# EAGLE design adamon (EAGLE 6.5.0)
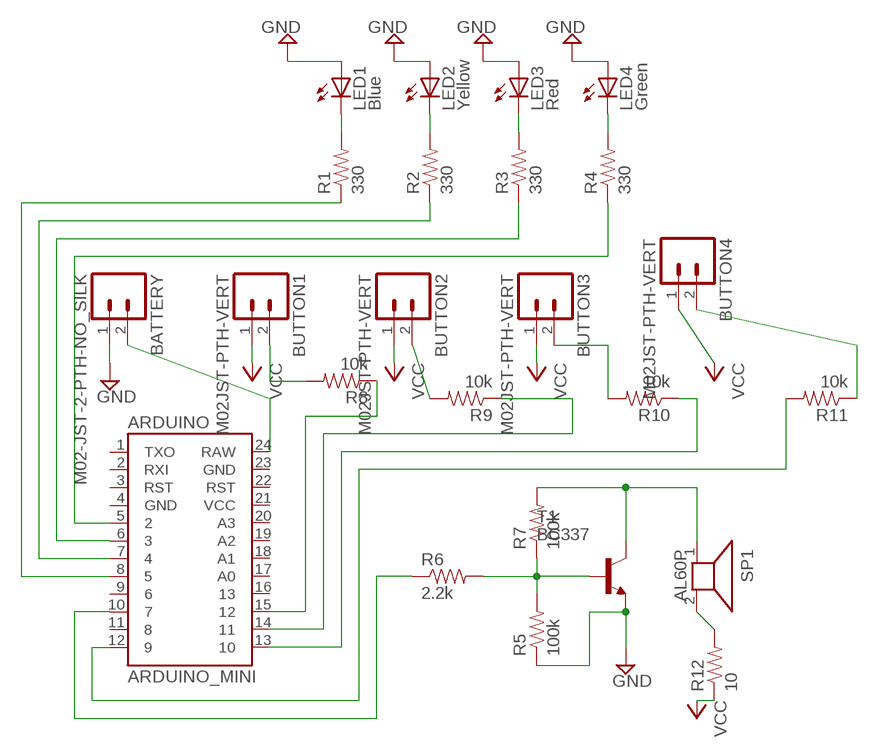
[diagram p0: schematic, sheet 1]

## Parts
ARDUINO  ARDUINO_MINI  [ARDUINO_MINI]
BATTERY  M02-JST-2-PTH-NO_SILK  [JST-2-PTH-NS]
BUTTON1  M02JST-PTH-VERT  [JST-2-PTH-VERT]
BUTTON2  M02JST-PTH-VERT  [JST-2-PTH-VERT]
BUTTON3  M02JST-PTH-VERT  [JST-2-PTH-VERT]
BUTTON4  M02JST-PTH-VERT  [JST-2-PTH-VERT]
LED1  Blue  LED5MM  [LED5MM]
LED2  Yellow  LED5MM  [LED5MM]
LED3  Red  LED5MM  [LED5MM]
LED4  Green  LED5MM  [LED5MM]
R1  330  RESISTORPTH-1/4W  [AXIAL-0.4]
R2  330  RESISTORPTH-1/4W  [AXIAL-0.4]
R3  330  RESISTORPTH-1/4W  [AXIAL-0.4]
R4  330  RESISTORPTH-1/4W  [AXIAL-0.4]
R5  100k  RESISTORPTH-1/4W  [AXIAL-0.4]
R6  2.2k  RESISTORPTH-1/4W  [AXIAL-0.4]
R7  100k  RESISTORPTH-1/4W  [AXIAL-0.4]
R8  10k  RESISTORPTH-1/4W  [AXIAL-0.4]
R9  10k  RESISTORPTH-1/4W  [AXIAL-0.4]
R10  10k  RESISTORPTH-1/4W  [AXIAL-0.4]
R11  10k  RESISTORPTH-1/4W  [AXIAL-0.4]
R12  10  RESISTORPTH-1/4W  [AXIAL-0.4]
SP1  AL60P  [AL60P]
T1  BC337  [TO92]

## Nets
GND: BATTERY.1 LED1.A LED2.A LED3.A LED4.A R5.P$1 T1.1(E)
N$1: LED1.K(C) R1.P$2
N$2: ARDUINO.8 R1.P$1
N$3: ARDUINO.7 R2.P$1
N$4: ARDUINO.6 R3.P$1
N$5: ARDUINO.5 R4.P$1
N$6: LED2.K(C) R2.P$2
N$7: LED3.K(C) R3.P$2
N$8: LED4.K(C) R4.P$2
N$9: BUTTON4.2 R11.P$1
N$10: BUTTON3.2 R10.P$2
N$12: BUTTON2.2 R9.P$2
N$13: ARDUINO.24(RAW) BATTERY.2
N$14: ARDUINO.15 R8.P$1
N$15: ARDUINO.14 R9.P$1
N$16: ARDUINO.13 R10.P$1
N$17: ARDUINO.12 R11.P$2
N$18: R5.P$2 R6.P$2 R7.P$1 T1.2(B)
N$19: R7.P$2 SP1.1 T1.3(C)
N$21: R12.P$2 SP1.2
N$23: BUTTON1.2 R8.P$2
SPKAMP: ARDUINO.10 R6.P$1
VCC: BUTTON1.1 BUTTON2.1 BUTTON3.1 BUTTON4.1 R12.P$1
Unconnected: ARDUINO.1(TXO) ARDUINO.2(RXI) ARDUINO.3(RST) ARDUINO.4(GND) ARDUINO.9 ARDUINO.11 ARDUINO.16 ARDUINO.17(A0) ARDUINO.18(A1) ARDUINO.19(A2) ARDUINO.20(A3) ARDUINO.21(VCC) ARDUINO.22(RST) ARDUINO.23(GND)

## Library data of the parts
ARDUINO = SparkFun-Boards:ARDUINO_MINI: Arduino Pro Mini footprint
BATTERY BUTTON1-BUTTON4 = SparkFun-Connectors:M02: Standard 2-pin 0.1" header. Use with - straight break away headers ( PRT-00116) - right angle break away headers (PRT-00553) - swiss pins (PRT-00743) - machine pins (PRT-00117) - female headers (PRT-00115) Molex polarized connector foot print use with: PRT-08233 with associated crimp pins and housings. 2.54_SCREWTERM for use with PRT-10571. 3.5mm Screw Terminal footprints for PRT-08084 5mm Screw Terminal footprints for use with PRT-08433
LED1-LED4 = SparkFun-LED:LED: LEDs Standard schematic elements and footprints for 5mm, 3mm, 1206, and 0603 sized LEDs. 5mm - Spark Fun Electronics SKU : COM-00529 (and others)
R1-R12 = SparkFun-Passives:RESISTOR: Resistor Basic schematic elements and footprints for 0603, 1206, and PTH resistors.
SP1 = buzzer:AL60P: SPEAKER Source: Buerklin; OC_FARNELL: unknown; OC_NEWARK: unknown
T1 = transistor:BC337: NPN TRANSISTOR

## Board
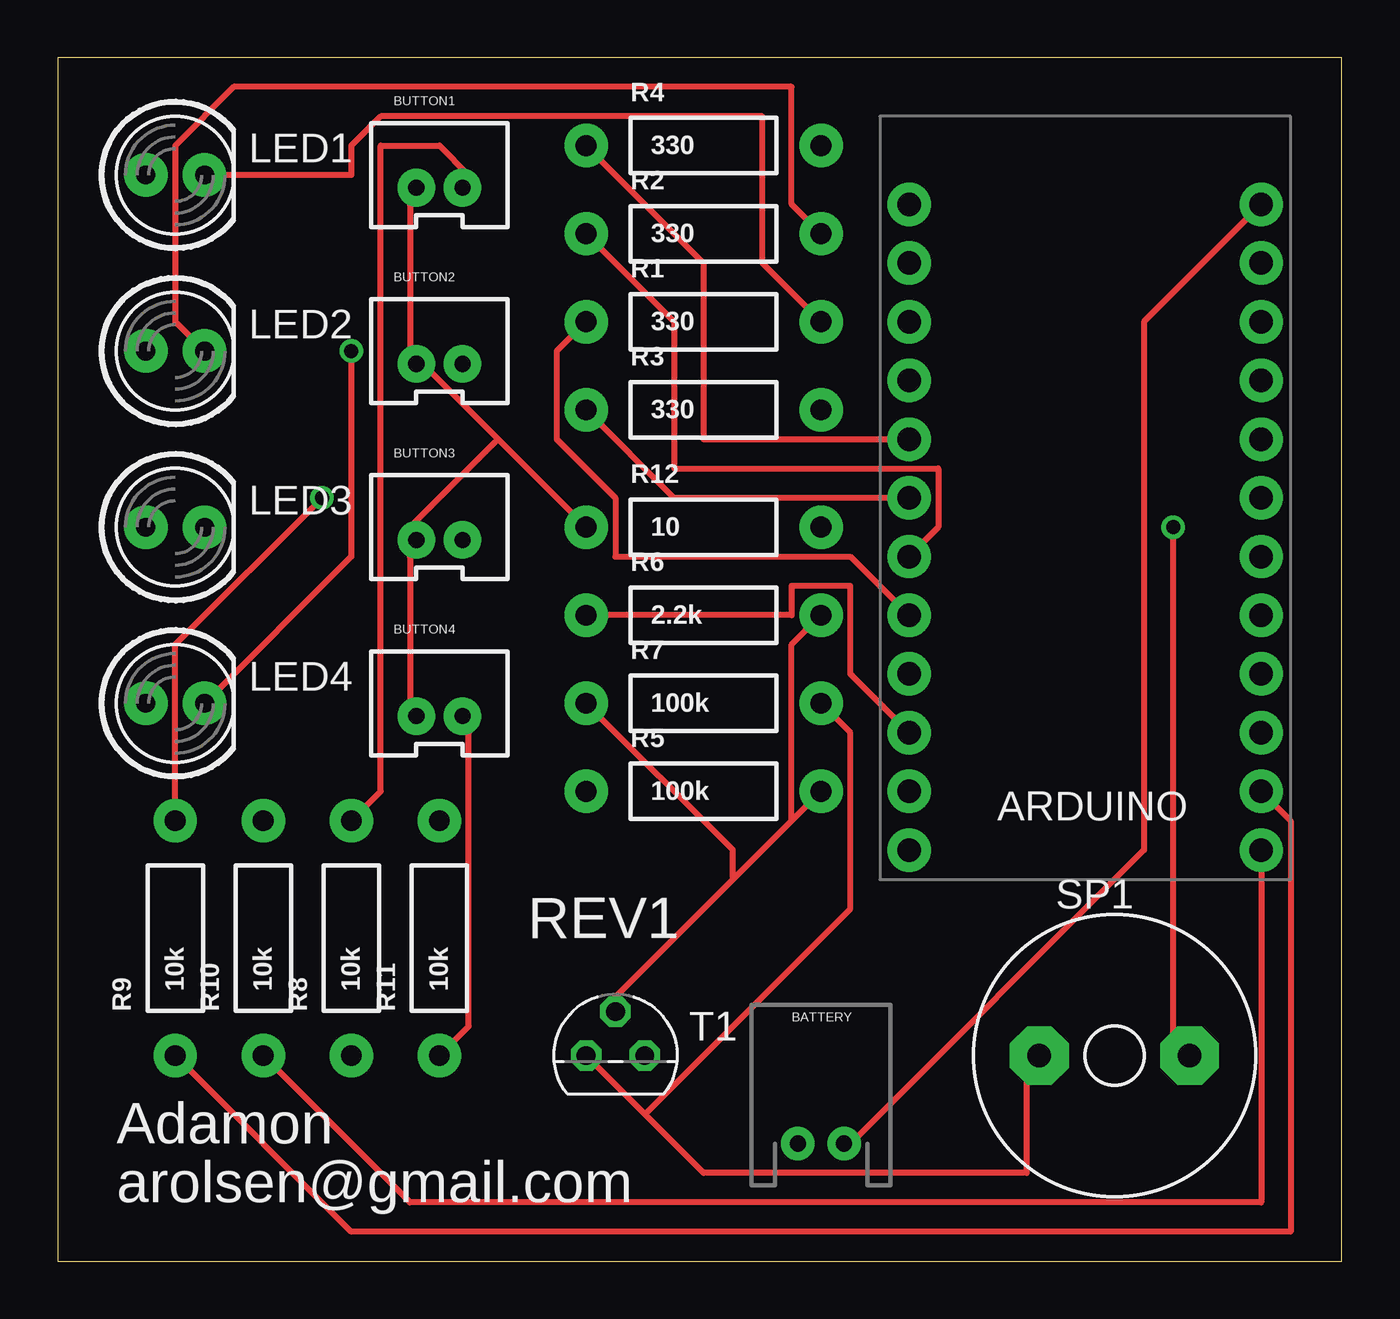
[diagram p1: board, top side]
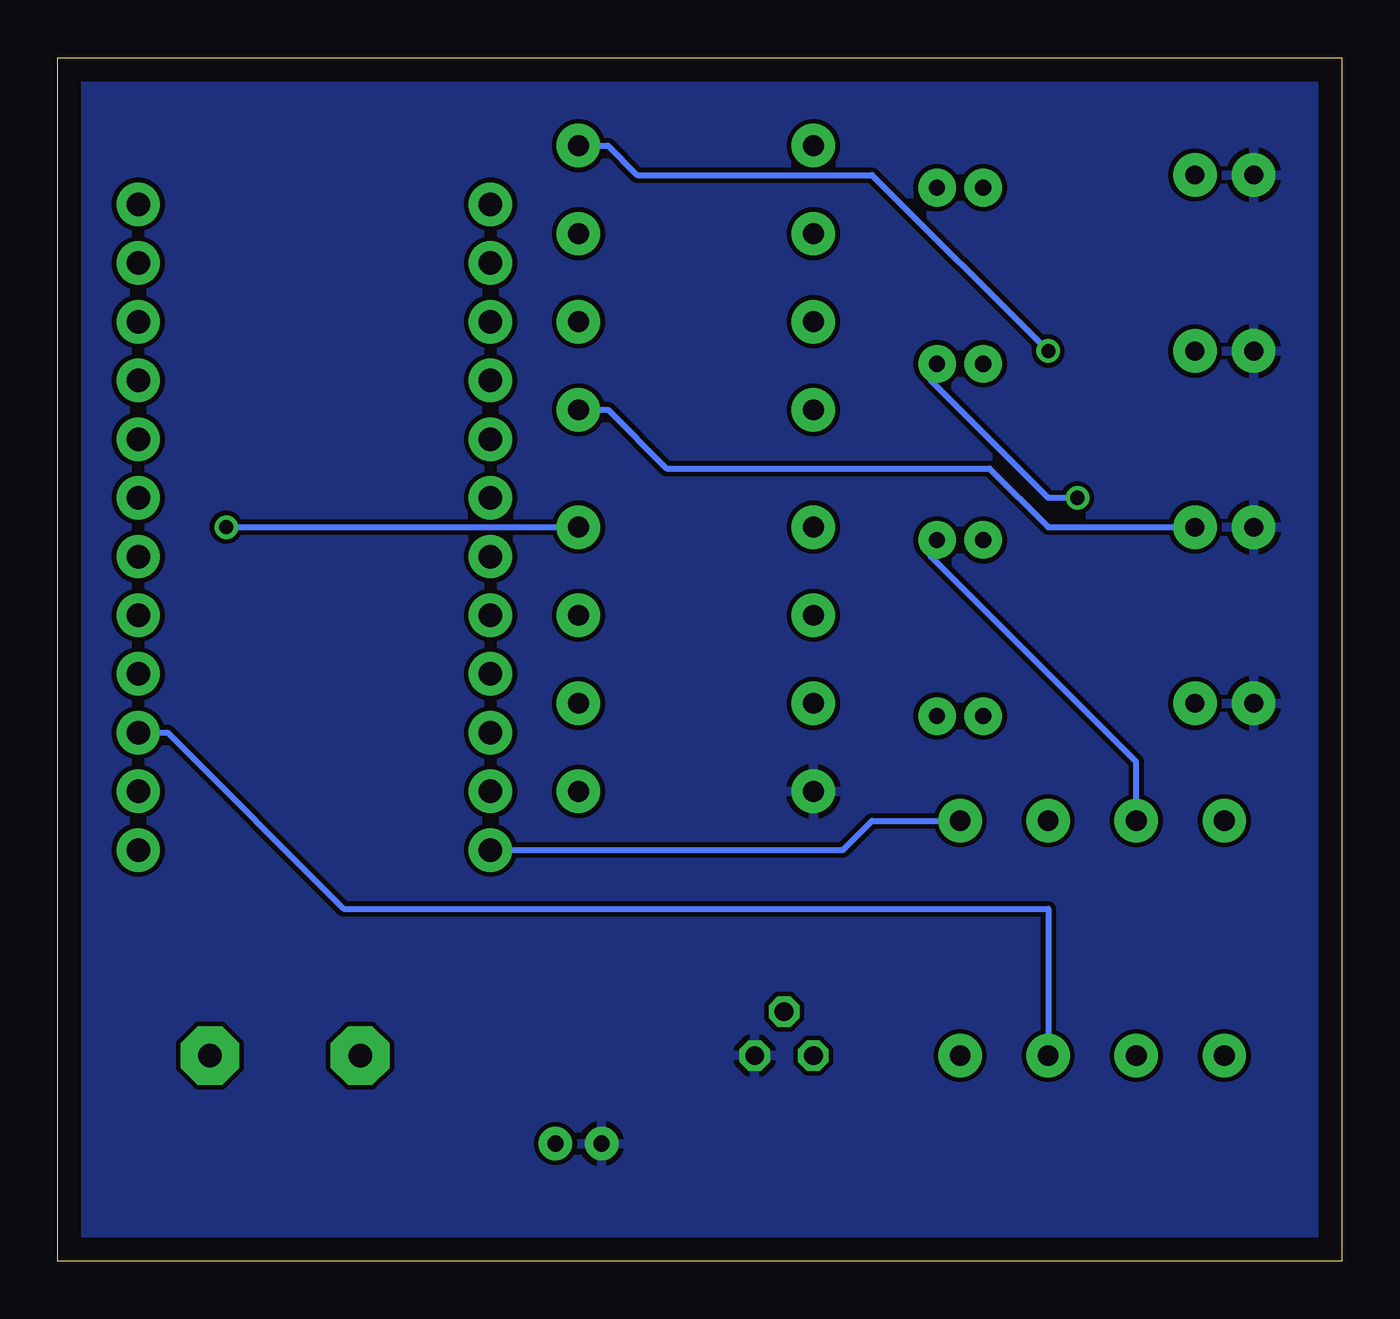
[diagram p2: board, bottom side, seen from below]

Size 55.55 x 52.06 mm. Coordinates in mm from the lower left corner, seen from the top.
Outline: 0,0 55.55,0 55.55,52.06 0,52.06 0,0
Copper layers (1*16): Top 0.035mm / dielectric 1.5mm / Bottom 0.035mm
Design rules "default": minimum track width 10mil, minimum drill 24mil, track to track 8mil, track to pad 8mil, pad to pad 8mil, via to via 8mil, smd to smd 8mil, copper to edge 40mil, drill to drill 8mil, minimum pad ring 10mil, minimum via ring 8mil, stop-mask expansion 4mil, vias tented up to drill 0mil, thermal gap 10mil

### Footprints (pad centres in the part's own frame; a part is rotated, then mirrored left to right if it is on the bottom)
ARDUINO_MINI = drill 1.016 pad 1.88: 1 -7.62,12.7; 2 -7.62,10.16; 3 -7.62,7.62; 4 -7.62,5.08; 5 -7.62,2.54; 6 -7.62,0; 7 -7.62,-2.54; 8 -7.62,-5.08; 9 -7.62,-7.62; 10 -7.62,-10.16; 11 -7.62,-12.7; 12 -7.62,-15.24; 13 7.62,-15.24; 14 7.62,-12.7; 15 7.62,-10.16; 16 7.62,-7.62; 17 7.62,-5.08; 18 7.62,-2.54; 19 7.62,0; 20 7.62,2.54; 21 7.62,5.08; 22 7.62,7.62; 23 7.62,10.16; 24 7.62,12.7
JST-2-PTH-NS = drill 0.7 pad 1.448: 1 -1,0; 2 1,0
JST-2-PTH-VERT = drill 0.7 pad 1.626: 1 -1,-0.55; 2 1,-0.55
LED5MM = drill 0.813 pad 1.88: A -1.27,0; K 1.27,0
AXIAL-0.4 = drill 0.9 pad 1.88: P$1 -5.08,0; P$2 5.08,0
AL60P = drill 1.016 pad 2.54 octagon: 1 -3.251,0; 2 3.251,0
TO92 = drill 0.813 octagon: 1 1.27,0; 2 0,1.905; 3 -1.27,0

### Placement (x,y rotation side)
ARDUINO  44.45,33.02 0 top
BATTERY  33.02,5.08 0 top
BUTTON1  16.51,46.99 0 top
BUTTON2  16.51,39.37 0 top
BUTTON3  16.51,31.75 0 top
BUTTON4  16.51,24.13 0 top
LED1  5.08,46.99 0 top
LED2  5.08,39.37 0 top
LED3  5.08,31.75 0 top
LED4  5.08,24.13 0 top
R1  27.94,40.64 0 top
R2  27.94,44.45 0 top
R3  27.94,36.83 0 top
R4  27.94,48.26 0 top
R5  27.94,20.32 0 top
R6  27.94,27.94 0 top
R7  27.94,24.13 0 top
R8  12.7,13.97 90 top
R9  5.08,13.97 90 top
R10  8.89,13.97 90 top
R11  16.51,13.97 90 top
R12  27.94,31.75 0 top
SP1  45.72,8.89 0 top
T1  24.13,8.89 0 top

### Tracks (layer width: path | path; a pad name or v marks a point on that pad's centre or on a via)
GND
  pour Bottom: 0,52.07 0,0 55.88,0 55.88,52.07
N$1
  Top 0.254: LED1.K 12.7,46.99 12.7,48.26 13.97,49.53 30.48,49.53 30.48,43.18 R1.P$2
N$2
  Top 0.254: ARDUINO.8 34.29,30.48 24.13,30.48 24.13,33.02 21.59,35.56 21.59,39.37 R1.P$1
N$3
  Top 0.254: ARDUINO.7 38.1,31.75 38.1,34.29 26.67,34.29 26.67,40.64 R2.P$1
N$4
  Top 0.254: R3.P$1 26.67,33.02 ARDUINO.6
N$5
  Top 0.254: ARDUINO.5 27.94,35.56 27.94,43.18 R4.P$1
N$6
  Top 0.254: LED2.K 5.08,40.64 5.08,48.26 7.62,50.8 31.75,50.8 31.75,45.72 R2.P$2
N$7
  Bottom 0.254: LED3.K 12.7,31.75 15.24,34.29 29.21,34.29 31.75,36.83 R3.P$2
N$8  (via drill 0.61)
  Top 0.254: LED4.K 12.7,30.48 v12.7,39.37
  Bottom 0.254: v12.7,39.37 20.32,46.99 30.48,46.99 31.75,48.26 R4.P$2
N$9
  Top 0.254: R11.P$1 17.78,10.16 17.78,22.86 BUTTON4.2
N$10
  Bottom 0.254: R10.P$2 8.89,21.59 17.78,30.48 BUTTON3.2
N$12  (via drill 0.61)
  Top 0.254: v11.43,33.02 5.08,26.67 R9.P$2
  Bottom 0.254: v11.43,33.02 12.7,33.02 17.78,38.1 BUTTON2.2
N$13
  Top 0.254: ARDUINO.24 46.99,40.64 46.99,17.78 34.29,5.08 BATTERY.2
N$14
  Bottom 0.254: R8.P$1 12.7,15.24 43.18,15.24 50.8,22.86 ARDUINO.15
N$15
  Top 0.254: R9.P$1 12.7,1.27 53.34,1.27 53.34,19.05 ARDUINO.14
N$16
  Top 0.254: R10.P$1 15.24,2.54 52.07,2.54 ARDUINO.13
N$17
  Bottom 0.254: R11.P$2 20.32,19.05 21.59,17.78 ARDUINO.12
N$18
  Top 0.254: R5.P$2 31.75,19.05 | 31.75,19.05 29.21,16.51 | 29.21,16.51 24.13,11.43 T1.2 | R7.P$1 29.21,17.78 29.21,16.51 | R6.P$2 31.75,26.67 31.75,19.05
N$19
  Top 0.254: 25.4,6.35 27.94,3.81 41.91,3.81 41.91,8.89 SP1.1 | 25.4,6.35 T1.3 | R7.P$2 34.29,22.86 34.29,15.24 25.4,6.35
N$21  (via drill 0.61)
  Top 0.254: v48.26,31.75 48.26,8.89 SP1.2
  Bottom 0.254: v48.26,31.75 R12.P$2
N$23
  Top 0.254: R8.P$2 13.97,20.32 13.97,48.26 16.51,48.26 17.78,46.99 BUTTON1.2
SPKAMP
  Top 0.254: R6.P$1 31.75,27.94 31.75,29.21 34.29,29.21 34.29,25.4 ARDUINO.10
VCC
  Top 0.254: BUTTON4.1 15.24,24.13 15.24,30.48 BUTTON3.1 15.24,31.75 19.05,35.56 | 15.24,39.37 15.24,45.72 BUTTON1.1 | 15.24,39.37 19.05,35.56 | 19.05,35.56 R12.P$1 | 15.24,39.37 BUTTON2.1

### Text on the board
tPlace: REV1 | Adamon | arolsen@gmail.com